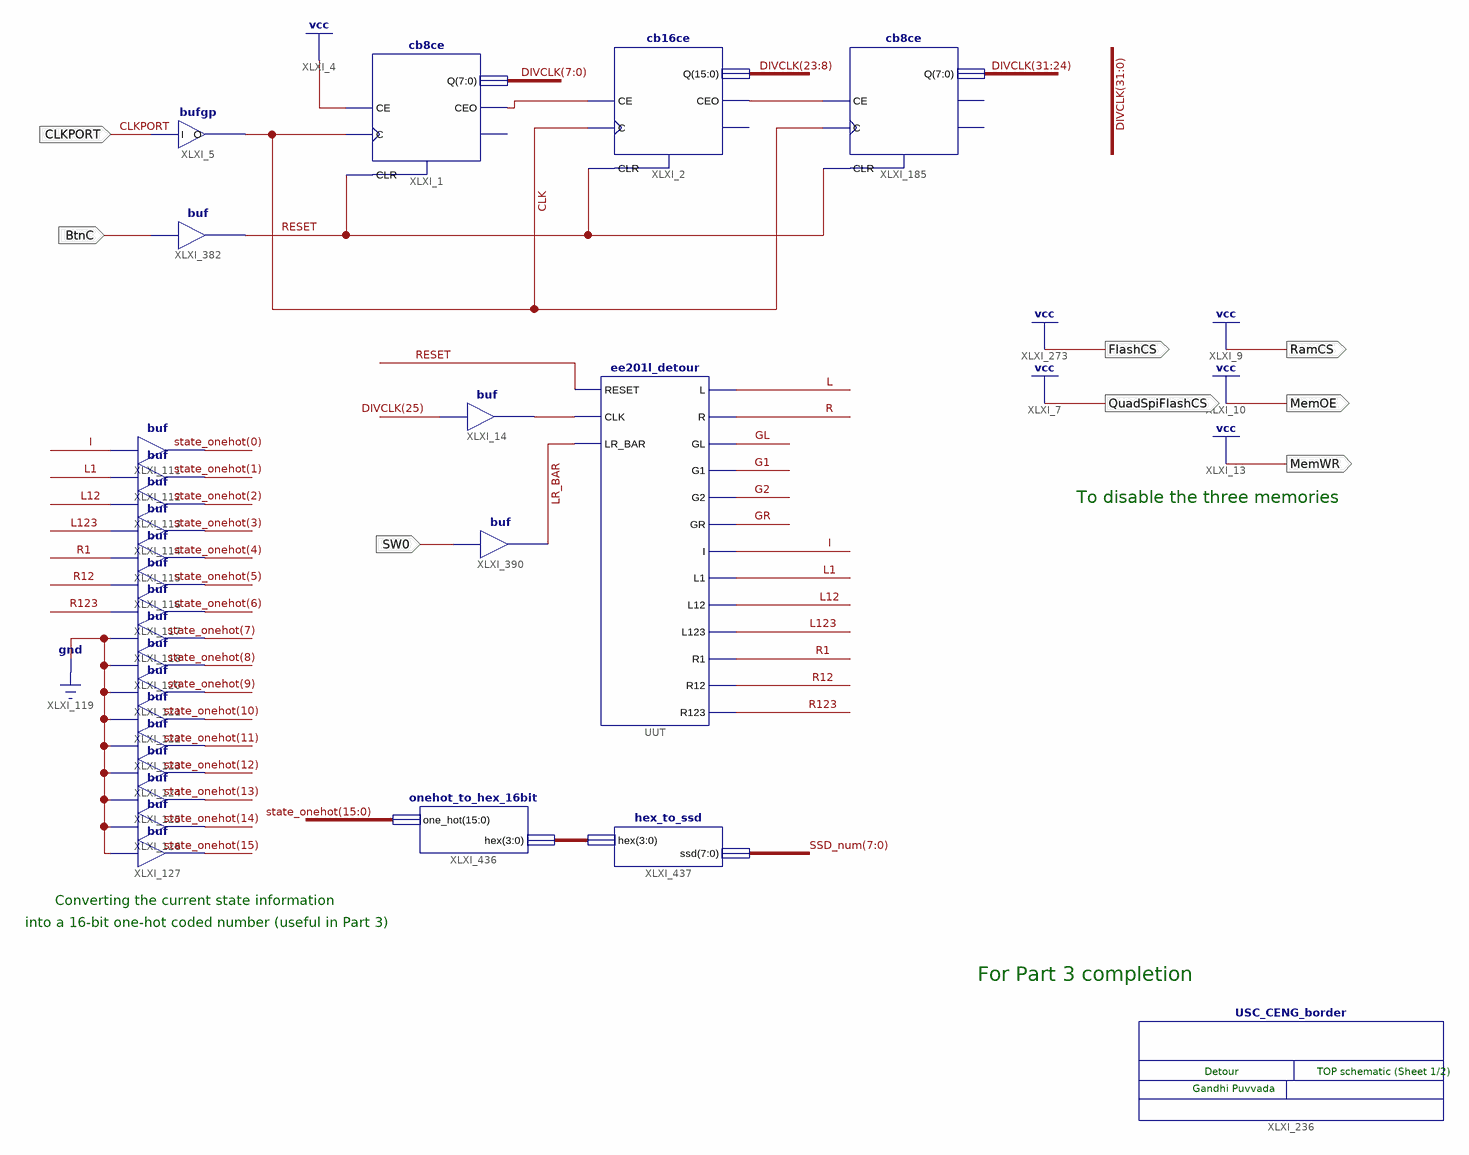
[diagram p0: schematic sheet 1]
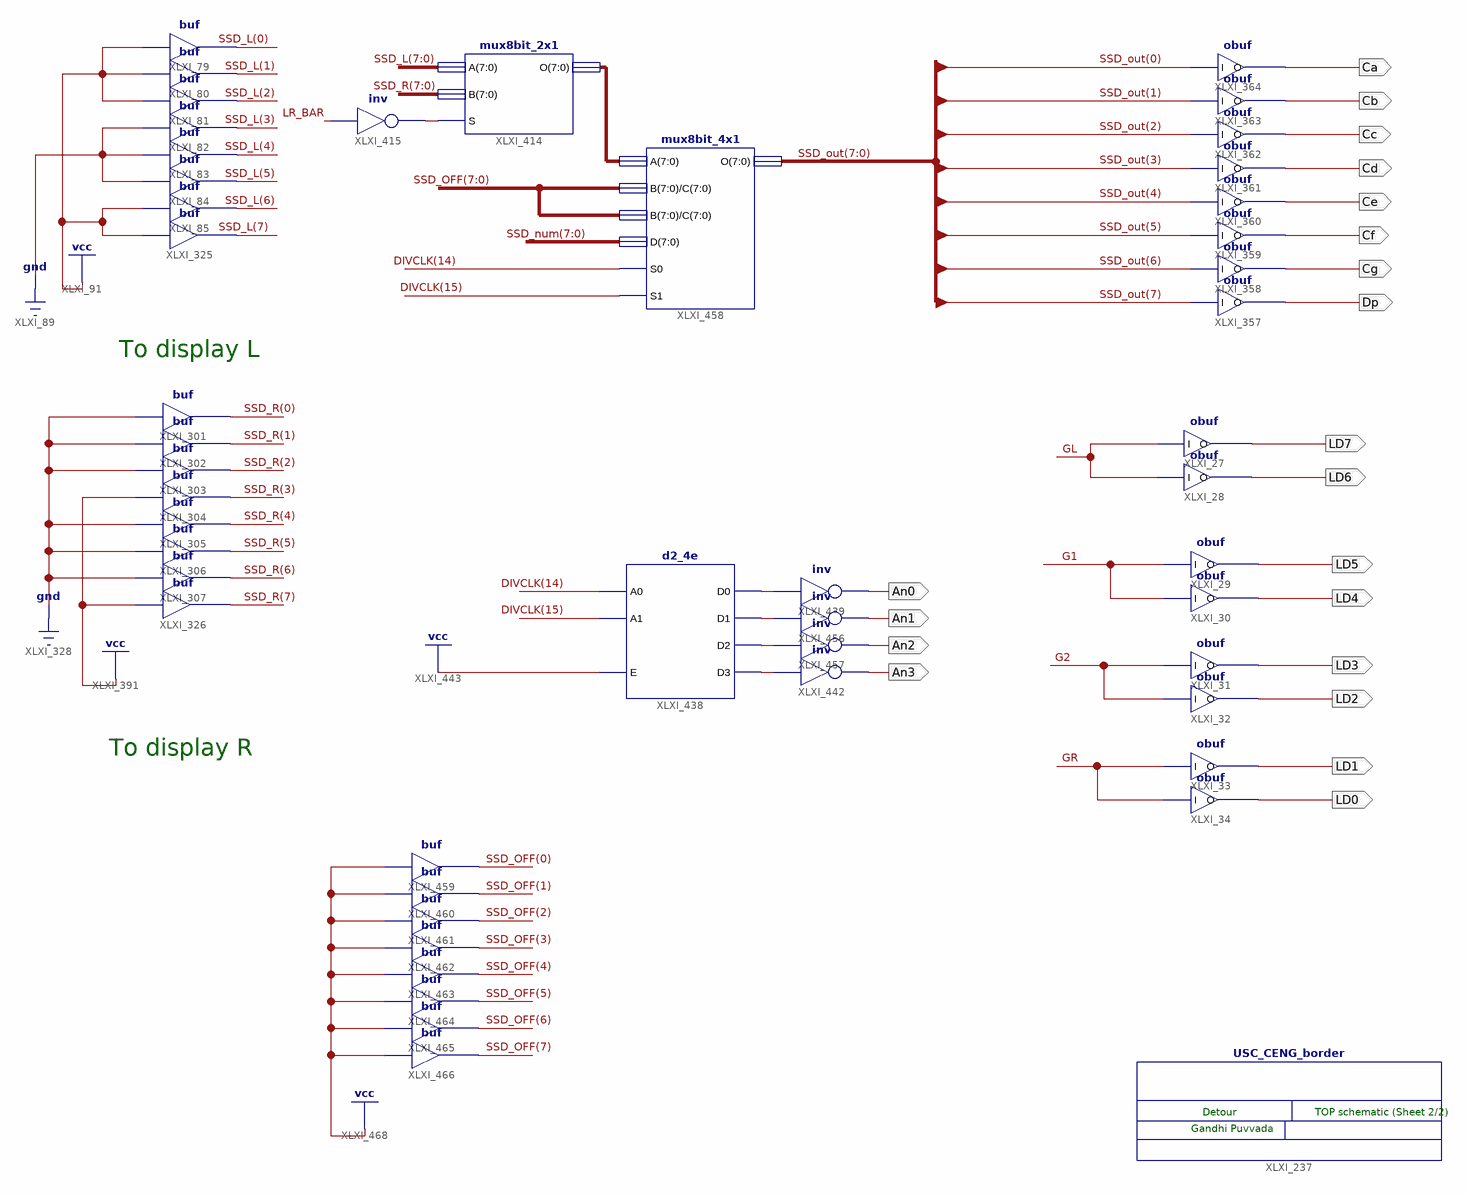
[diagram p1: schematic sheet 2]
// Xilinx ISE schematic ee201l_detour_top.sch (spartan6) as structural Verilog: 76 symbols, 28 ports
module ee201l_detour_top (
  input  CLKPORT,
  input  BtnC,
  input  SW0,
  output Ca,
  output Cb,
  output Cc,
  output Cd,
  output Ce,
  output Cf,
  output Cg,
  output Dp,
  output LD6,
  output LD7,
  output LD3,
  output LD2,
  output LD1,
  output LD0,
  output LD4,
  output LD5,
  output RamCS,
  output MemOE,
  output MemWR,
  output FlashCS,
  output QuadSpiFlashCS,
  output An0,
  output An3,
  output An1,
  output An2
);

  wire CLK, G1, G2, GL, GR, I, L, L1, L12, L123, LR_BAR, R, R1, R12, R123, RESET, XLXN_1, XLXN_522, XLXN_809,
       XLXN_841, XLXN_867, XLXN_868, XLXN_869, XLXN_870;
  wire [3:0] XLXN_856;
  wire [7:0] SSD_L, SSD_num, SSD_OFF, SSD_out, SSD_R, XLXN_837;
  wire [15:0] state_onehot;
  wire [31:0] DIVCLK;

  buf XLXI_79 (SSD_L[0], 1'b1);
  buf XLXI_80 (SSD_L[1], 1'b1);
  buf XLXI_81 (SSD_L[2], 1'b1);
  buf XLXI_82 (SSD_L[3], 1'b0);
  buf XLXI_83 (SSD_L[4], 1'b0);
  buf XLXI_84 (SSD_L[5], 1'b0);
  buf XLXI_85 (SSD_L[6], 1'b1);
  cb8ce XLXI_1 (.C(CLK), .CE(1'b1), .CLR(RESET), .CEO(XLXN_1), .Q(DIVCLK[7:0]));  // open: TC
  bufgp XLXI_5 (.I(CLKPORT), .O(CLK));
  cb8ce XLXI_185 (.C(CLK), .CE(XLXN_522), .CLR(RESET), .Q(DIVCLK[31:24]));  // open: CEO, TC
  cb16ce XLXI_2 (.C(CLK), .CE(XLXN_1), .CLR(RESET), .CEO(XLXN_522), .Q(DIVCLK[23:8]));  // open: TC
  USC_CENG_border XLXI_236 ();
  USC_CENG_border XLXI_237 ();
  obuf XLXI_28 (.I(GL), .O(LD6));
  obuf XLXI_27 (.I(GL), .O(LD7));
  obuf XLXI_31 (.I(G2), .O(LD3));
  obuf XLXI_32 (.I(G2), .O(LD2));
  obuf XLXI_33 (.I(GR), .O(LD1));
  obuf XLXI_34 (.I(GR), .O(LD0));
  obuf XLXI_30 (.I(G1), .O(LD4));
  obuf XLXI_29 (.I(G1), .O(LD5));
  ee201l_detour UUT (
    .RESET(RESET), .CLK(XLXN_809), .LR_BAR(LR_BAR), .L(L), .R(R), .G1(G1), .G2(G2), .GR(GR), .GL(GL), .I(I),
    .R1(R1), .R12(R12), .R123(R123), .L1(L1), .L12(L12), .L123(L123));
  buf XLXI_14 (XLXN_809, DIVCLK[25]);
  buf XLXI_111 (state_onehot[0], I);
  buf XLXI_112 (state_onehot[1], L1);
  buf XLXI_113 (state_onehot[2], L12);
  buf XLXI_114 (state_onehot[3], L123);
  buf XLXI_115 (state_onehot[4], R1);
  buf XLXI_116 (state_onehot[5], R12);
  buf XLXI_117 (state_onehot[6], R123);
  buf XLXI_118 (state_onehot[7], 1'b0);
  buf XLXI_120 (state_onehot[8], 1'b0);
  buf XLXI_121 (state_onehot[9], 1'b0);
  buf XLXI_122 (state_onehot[10], 1'b0);
  buf XLXI_123 (state_onehot[11], 1'b0);
  buf XLXI_124 (state_onehot[12], 1'b0);
  buf XLXI_125 (state_onehot[13], 1'b0);
  buf XLXI_126 (state_onehot[14], 1'b0);
  buf XLXI_127 (state_onehot[15], 1'b0);
  buf XLXI_301 (SSD_R[0], 1'b0);
  buf XLXI_302 (SSD_R[1], 1'b0);
  buf XLXI_303 (SSD_R[2], 1'b0);
  buf XLXI_304 (SSD_R[3], 1'b1);
  buf XLXI_305 (SSD_R[4], 1'b0);
  buf XLXI_306 (SSD_R[5], 1'b0);
  buf XLXI_307 (SSD_R[6], 1'b0);
  buf XLXI_325 (SSD_L[7], 1'b1);
  buf XLXI_326 (SSD_R[7], 1'b1);
  obuf XLXI_357 (.I(SSD_out[7]), .O(Dp));
  obuf XLXI_358 (.I(SSD_out[6]), .O(Cg));
  obuf XLXI_359 (.I(SSD_out[5]), .O(Cf));
  obuf XLXI_360 (.I(SSD_out[4]), .O(Ce));
  obuf XLXI_361 (.I(SSD_out[3]), .O(Cd));
  obuf XLXI_362 (.I(SSD_out[2]), .O(Cc));
  obuf XLXI_363 (.I(SSD_out[1]), .O(Cb));
  obuf XLXI_364 (.I(SSD_out[0]), .O(Ca));
  buf XLXI_382 (RESET, BtnC);
  buf XLXI_390 (LR_BAR, SW0);
  not XLXI_415 (XLXN_841, LR_BAR);
  mux8bit_2x1 XLXI_414 (.A(SSD_L), .B(SSD_R), .O(XLXN_837), .S(XLXN_841));
  onehot_to_hex_16bit XLXI_436 (.hex(XLXN_856), .one_hot(state_onehot));
  hex_to_ssd XLXI_437 (.ssd(SSD_num), .hex(XLXN_856));
  not XLXI_439 (An0, XLXN_867);
  not XLXI_442 (An3, XLXN_870);
  d2_4e XLXI_438 (
    .A0(DIVCLK[14]), .A1(DIVCLK[15]), .E(1'b1), .D0(XLXN_867), .D1(XLXN_868), .D2(XLXN_869), .D3(XLXN_870));
  not XLXI_456 (An1, XLXN_868);
  not XLXI_457 (An2, XLXN_869);
  mux8bit_4x1 XLXI_458 (
    .A(XLXN_837), .B(SSD_OFF), .C(SSD_OFF), .D(SSD_num), .O(SSD_out), .S0(DIVCLK[14]), .S1(DIVCLK[15]));
  buf XLXI_459 (SSD_OFF[0], 1'b1);
  buf XLXI_460 (SSD_OFF[1], 1'b1);
  buf XLXI_461 (SSD_OFF[2], 1'b1);
  buf XLXI_462 (SSD_OFF[3], 1'b1);
  buf XLXI_463 (SSD_OFF[4], 1'b1);
  buf XLXI_464 (SSD_OFF[5], 1'b1);
  buf XLXI_465 (SSD_OFF[6], 1'b1);
  buf XLXI_466 (SSD_OFF[7], 1'b1);

  assign FlashCS = 1'b1;
  assign MemOE = 1'b1;
  assign MemWR = 1'b1;
  assign QuadSpiFlashCS = 1'b1;
  assign RamCS = 1'b1;

  // Notes on the sheet:
  //   To disable the three memories
  //   Converting the current state information
  //   into a 16-bit one-hot coded number (useful in Part 3)
  //   For Part 3 completion
  //   Detour
  //   TOP schematic (Sheet 1/2)
  //   Gandhi Puvvada
  //   To display L
  //   To display R
  //   Detour
  //   TOP schematic (Sheet 2/2)
  //   Gandhi Puvvada
endmodule
